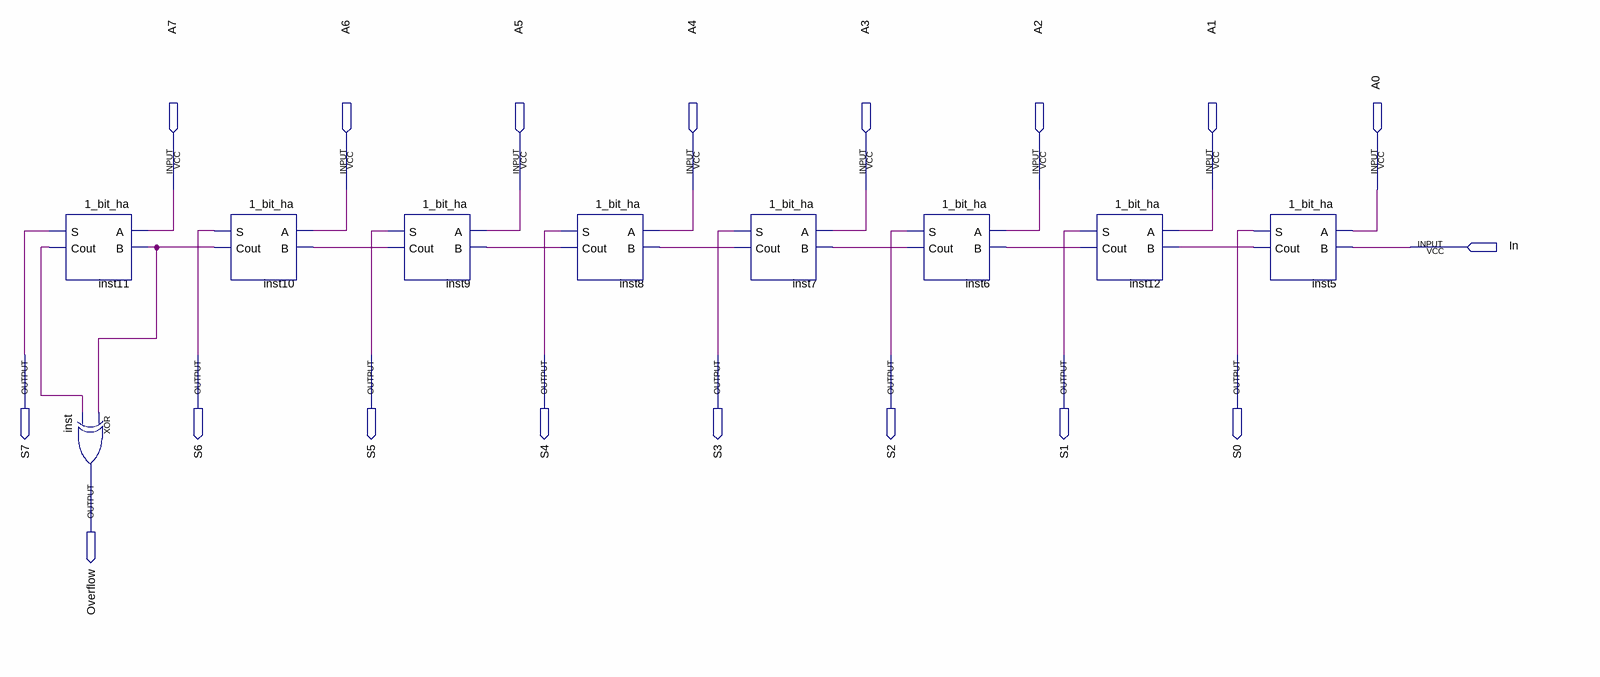
[diagram p0: schematic sheet]
// Quartus schematic 8_bit_add_sub_ha.bdf as structural Verilog: 9 symbols, 18 pins
module \8_bit_add_sub_ha  (
  input  A7,
  input  A6,
  input  A5,
  input  A4,
  input  A3,
  input  A2,
  input  A1,
  input  A0,
  input  In,
  output S7,
  output S6,
  output S5,
  output S4,
  output S3,
  output S2,
  output S1,
  output S0,
  output Overflow
);

  wire inst5_cout, inst6_cout, inst7_cout, inst8_cout, inst9_cout, inst10_cout, inst11_cout, inst12_cout;

  \1_bit_ha  inst11 (.A(A7), .B(inst10_cout), .S(S7), .Cout(inst11_cout));
  xor inst (Overflow, inst10_cout, inst11_cout);
  \1_bit_ha  inst10 (.A(A6), .B(inst9_cout), .S(S6), .Cout(inst10_cout));
  \1_bit_ha  inst9 (.A(A5), .B(inst8_cout), .S(S5), .Cout(inst9_cout));
  \1_bit_ha  inst8 (.A(A4), .B(inst7_cout), .S(S4), .Cout(inst8_cout));
  \1_bit_ha  inst7 (.A(A3), .B(inst6_cout), .S(S3), .Cout(inst7_cout));
  \1_bit_ha  inst6 (.A(A2), .B(inst12_cout), .S(S2), .Cout(inst6_cout));
  \1_bit_ha  inst12 (.A(A1), .B(inst5_cout), .S(S1), .Cout(inst12_cout));
  \1_bit_ha  inst5 (.A(A0), .B(In), .S(S0), .Cout(inst5_cout));
endmodule
